# Altium schematic sheet MCU.SchDoc
size A; SheetNumber: 1; SheetTotal: 4
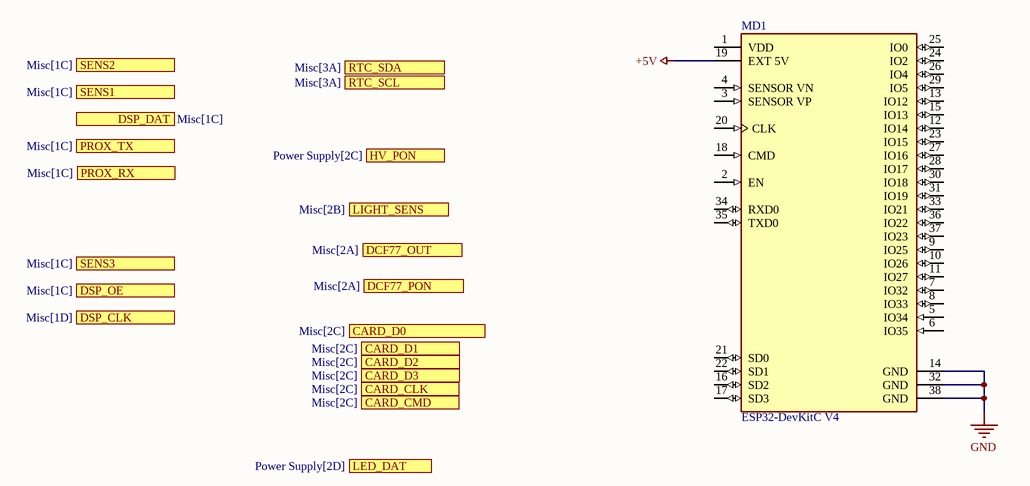
[diagram p0: MCU.SchDoc]

## Parts
MD1  ESP32-DevKitC V4  [FP-ESP32-DevKitC_V4-MFG]

## Ports
CARD_CLK (see Misc[2C]), CARD_CMD (see Misc[2C]), CARD_D0 (see Misc[2C]), CARD_D1 (see Misc[2C]), CARD_D2 (see Misc[2C]), CARD_D3 (see Misc[2C]), DCF77_OUT (see Misc[2A]), DCF77_PON (see Misc[2A]), DSP_CLK (see Misc[1D]), DSP_DAT (see Misc[1C]), DSP_OE (see Misc[1C]), HV_PON (see Power Supply[2C]), LED_DAT (see Power Supply[2D]), LIGHT_SENS (see Misc[2B]), PROX_RX (see Misc[1C]), PROX_TX (see Misc[1C]), RTC_SCL (see Misc[3A]), RTC_SDA (see Misc[3A]), SENS1 (see Misc[1C]), SENS2 (see Misc[1C]), SENS3 (see Misc[1C])

## Nets
+5V: MD1.19(EXT_5V)
GND: MD1.14(GND) MD1.32(GND) MD1.38(GND)

Not connected (* = marked no-connect by the designer): MD1 1(VDD) 2(EN) 3(SENSOR_VP) 4(SENSOR_VN) 5(IO34) 6(IO35) 7(IO32) 8(IO33) 9(IO25) 10(IO26) 11(IO27) 12(IO14) 13(IO12) 15(IO13) 16(SD2) 17(SD3) 18(CMD) 20(CLK) 21(SD0) 22(SD1) 23(IO15) 24(IO2) 25(IO0) 26(IO4) 27(IO16) 28(IO17) 29(IO5) 30(IO18) 31(IO19) 33(IO21) 34(RXD0) 35(TXD0) 36(IO22) 37(IO23)

## Library data of the parts
MD1 = CMP-194065-000004-1: WiFi Development Tools (802.11) ESP32 General Development Kit, ESP32-WROOM-32 on the board; Manufacturer: Espressif; Number Of Adc Channels: 16; Max Supply Voltage: 5V; Bandwidth: 2.4-2.5GHz; Interface: I2C,SPI,UART,I2S; Max Frequency: 2.5GHz; Min Supply Voltage: 2.7V; Number Of Gpio: 22; Package: ESP32-DevKitC V4; Device Class L2: RF Semiconductors and Devices; Device Class L3: Transceivers; ComponentLink2Description: Datasheet; Temperature Range Low: -40°C; ComponentLink2URL: https://docs.espressif.com/projects/esp-idf/en/latest/get-started/get-started-devkitc.html; RoHS: TRUE; Category: UNK; Automotive: No; Device Class L1: Integrated Circuits (ICs); Manufacturer Part Number: ESP32-DevKitC V4; Octopart: https://octopart.com/esp32-devkitc+v4-espressif+systems-107467262; Lead Free: Yes; Temperature: -40°C to